# Altium schematic sheet MCU.SchDoc
size A; SheetNumber: 2; SheetTotal: 2
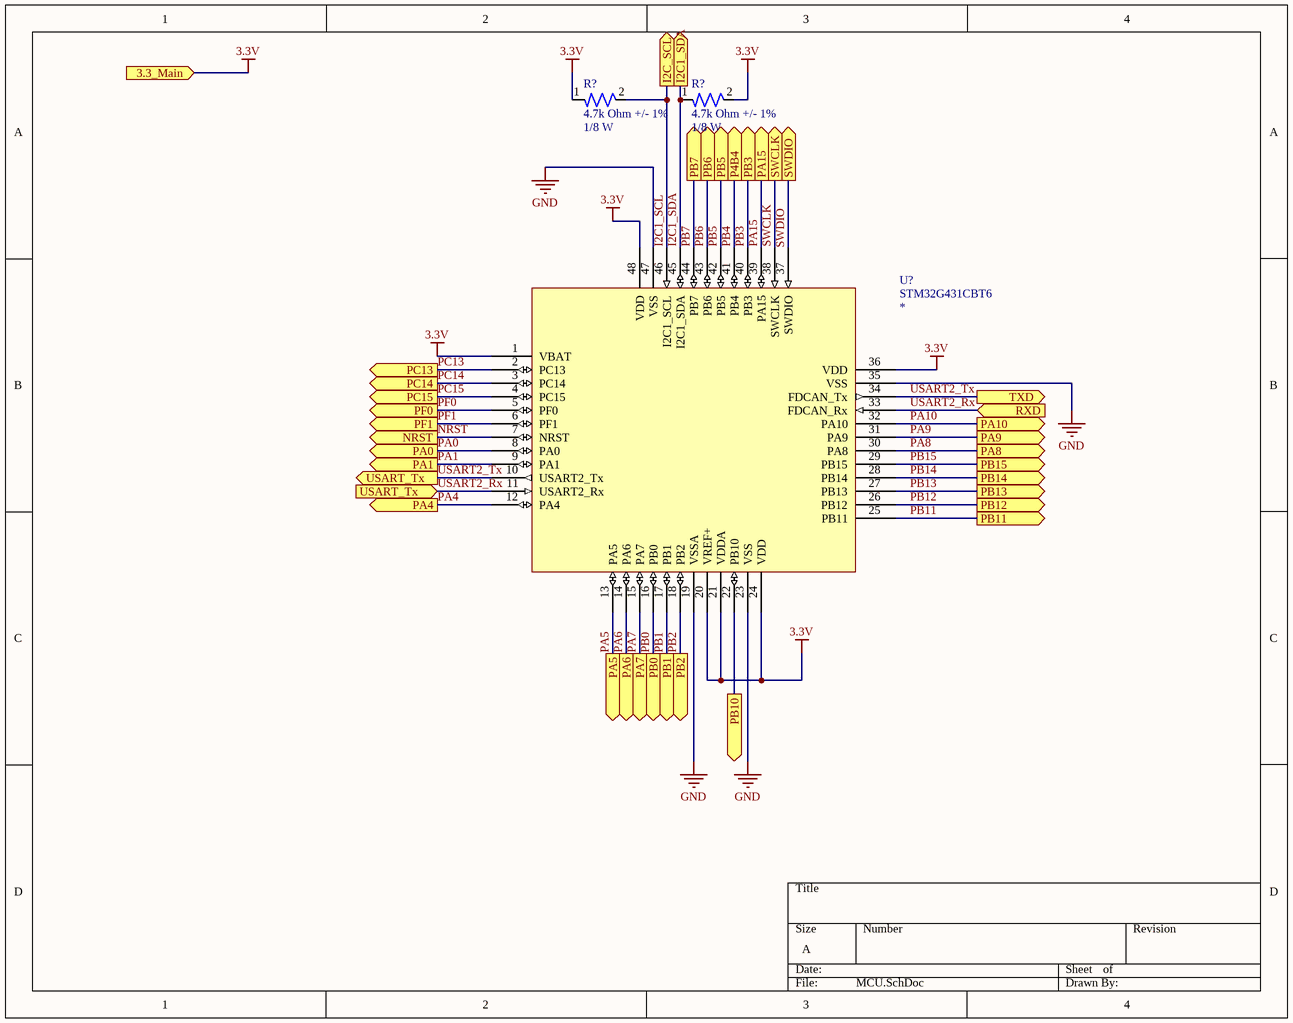
[diagram p0: MCU.SchDoc]

## Parts
(Parts that share a designator on the sheet are numbered #1, #2 ... from top to bottom, then left to right.)
R?#1  Resistance: 4.7k Ohm +/- 1%  Power: 1/8 W  [RES-0402]  (hidden comment: RC0402FR-7W4K7L)
R?#2  Resistance: 4.7k Ohm +/- 1%  Power: 1/8 W  [RES-0402]  (hidden comment: RC0402FR-7W4K7L)
U?  STM32G431CBT6  [Quad48]

## Ports
3.3_Main (in), I2C1_SDA (out), I2C_SCL (out), NRST (out), P4B4 (out), PA0 (out), PA1 (out), PA4 (out), PA5 (out), PA6 (out), PA7 (out), PA8 (out), PA9 (out), PA10 (out), PA15 (out), PB0 (out), PB1 (out), PB2 (out), PB3 (out), PB5 (out), PB6 (out), PB7 (out), PB10 (out), PB11 (out), PB12 (out), PB13 (out), PB14 (out), PB15 (out), PC13 (out), PC14 (out), PC15 (out), PF0 (out), PF1 (out), RXD (in), SWCLK (out), SWDIO (out), TXD (out), USART_Tx (in), USART_Tx (out)

## Nets
3.3V: R?#1.1 R?#2.2 U?.1(VBAT) U?.20(VREF+) U?.21(VDDA) U?.24(VDD) U?.36(VDD) U?.48(VDD) ; port 3.3_Main
GND: U?.19(VSSA) U?.23(VSS) U?.35(VSS) U?.47(VSS)
I2C1_SCL: R?#1.2 U?.46(I2C1_SCL) ; port I2C_SCL
I2C1_SDA: R?#2.1 U?.45(I2C1_SDA) ; port I2C1_SDA
NRST: U?.7(NRST) ; port NRST
PA0: U?.8(PA0) ; port PA0
PA1: U?.9(PA1) ; port PA1
PA4: U?.12(PA4) ; port PA4
PA5: U?.13(PA5) ; port PA5
PA6: U?.14(PA6) ; port PA6
PA7: U?.15(PA7) ; port PA7
PA8: U?.30(PA8) ; port PA8
PA9: U?.31(PA9) ; port PA9
PA10: U?.32(PA10) ; port PA10
PA15: U?.39(PA15) ; port PA15
PB0: U?.16(PB0) ; port PB0
PB1: U?.17(PB1) ; port PB1
PB2: U?.18(PB2) ; port PB2
PB3: U?.40(PB3) ; port PB3
PB4: U?.41(PB4) ; port P4B4
PB5: U?.42(PB5) ; port PB5
PB6: U?.43(PB6) ; port PB6
PB7: U?.44(PB7) ; port PB7
PB10: U?.22(PB10) ; port PB10
PB11: U?.25(PB11) ; port PB11
PB12: U?.26(PB12) ; port PB12
PB13: U?.27(PB13) ; port PB13
PB14: U?.28(PB14) ; port PB14
PB15: U?.29(PB15) ; port PB15
PC13: U?.2(PC13) ; port PC13
PC14: U?.3(PC14) ; port PC14
PC15: U?.4(PC15) ; port PC15
PF0: U?.5(PF0) ; port PF0
PF1: U?.6(PF1) ; port PF1
SWCLK: U?.38(SWCLK) ; port SWCLK
SWDIO: U?.37(SWDIO) ; port SWDIO
USART2_Rx: U?.10(USART2_Tx) U?.11(USART2_Rx) U?.33(FDCAN_Rx) U?.34(FDCAN_Tx) ; port TXD, port RXD, port USART_Tx  [also labelled USART2_Tx]

## Notes on the sheet
- Labels drawn without touching a wire or pin: SWDIO

## Library data of the parts
R?#1 R?#2 = RES-4.7K-0003-JLC: 125mW Thick Film Resistors 50V ±1% ±200ppm/℃ -55℃~+155℃ 4.7kΩ 0402  Chip Resistor - Surface Mount ROHS; assembled?: yes; JLC part number: C606173
U? = IC-STM32G431CBT6-0001: ARM® Cortex®-M4F STM32G4 Microcontroller IC 32-Bit Single-Core 170MHz 128KB (128K x 8) FLASH 48-LQFP (7x7); Parameter 1: *